# EAGLE design td-1x4 (EAGLE 6.6.0)
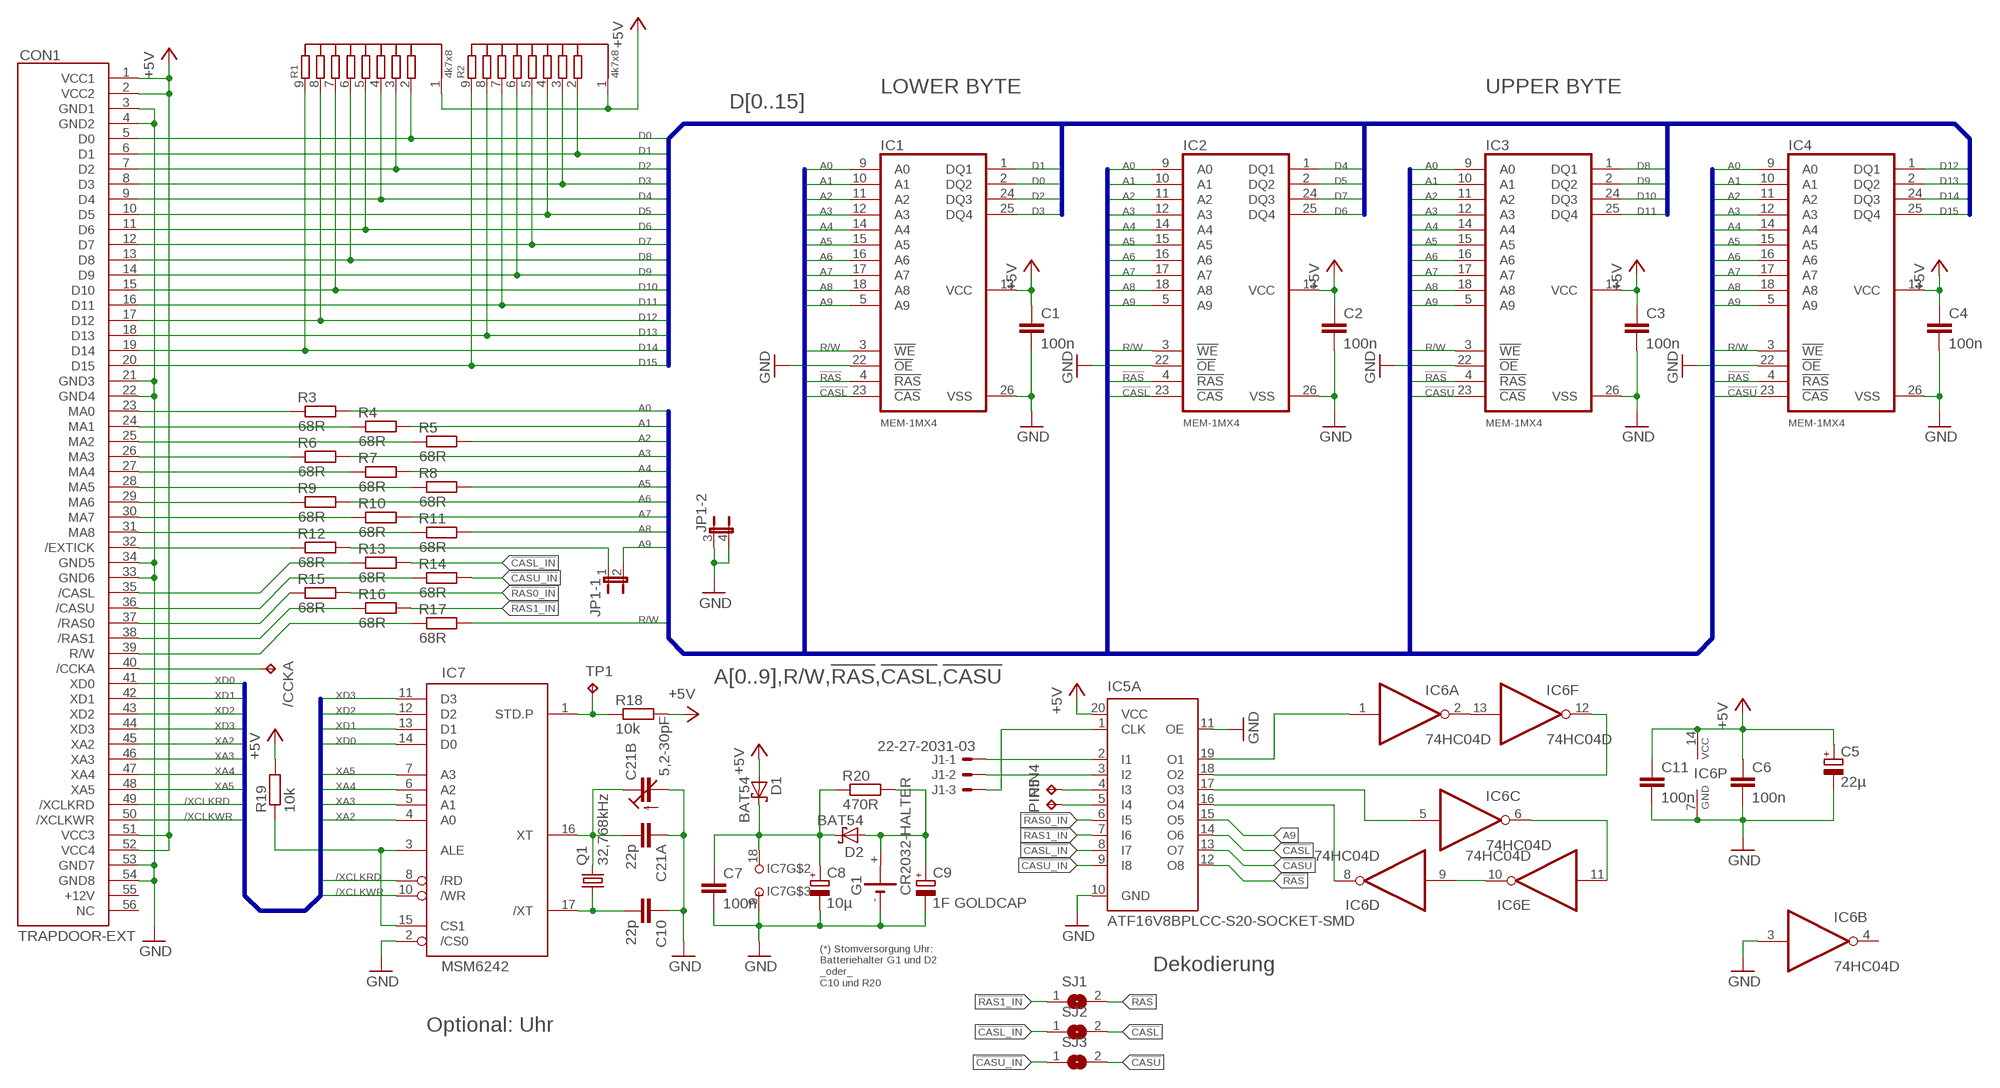
[diagram p0: schematic, sheet 1]

## Parts
/CCKA  PIN2  TPB1,27  [B1,27]
C1  100n  C-EUC0805  [C0805]
C2  100n  C-EUC0805  [C0805]
C3  100n  C-EUC0805  [C0805]
C4  100n  C-EUC0805  [C0805]
C5  22µ  CPOL-EUSMCC  [SMC_C]
C6  100n  C-EUC0805  [C0805]
C7  100n  C-EUC0805  [C0805]
C8  10µ  CPOL-EUSMCA  [SMC_A]
C9  1F GOLDCAP  GOLDCAP5GOLDCAP20-5  [GOLDCAP-5]
C10  22p  C-EUC0805  [C0805]
C11  100n  C-EUC0805  [C0805]
C21A  22p  C-EUC0805  [C0805]
C21B  5,2-30pF  C-TRIMM3050.504  [CTRIM3050.504]
CON1  TRAPDOOR-EXT  [2X28/90]
D1  BAT54  [SOT23]
D2  BAT54  [SOT23]
G1  CR2032-HALTER  CR2032HCR2032-HALTER  [HALTER2032]
IC1  MEM-1MX4  [SOJ26-20]
IC2  MEM-1MX4  [SOJ26-20]
IC3  MEM-1MX4  [SOJ26-20]
IC4  MEM-1MX4  [SOJ26-20]
IC5A  ATF16V8BPLCC-S20-SOCKET-SMD  [PLCC-S20-SOCKET-SMD]
IC6  74HC04D  [SO14]
IC7  MSM6242  [DIL18]
J1  22-27-2031-03  [6410-03]
JP1  JP2QE  [JP2Q]
PIN4  PIN4  TPB1,27  [B1,27]
PIN5  PIN5  TPB1,27  [B1,27]
Q1  32,768kHz  CRYSTALTC26V  [TC26V]
R1  4k7x8  RESNET8  [RN-9]
R2  4k7x8  RESNET8  [RN-9]
R3  68R  R-EU_R0805  [R0805]
R4  68R  R-EU_R0805  [R0805]
R5  68R  R-EU_R0805  [R0805]
R6  68R  R-EU_R0805  [R0805]
R7  68R  R-EU_R0805  [R0805]
R8  68R  R-EU_R0805  [R0805]
R9  68R  R-EU_R0805  [R0805]
R10  68R  R-EU_R0805  [R0805]
R11  68R  R-EU_R0805  [R0805]
R12  68R  R-EU_R0805  [R0805]
R13  68R  R-EU_R0805  [R0805]
R14  68R  R-EU_R0805  [R0805]
R15  68R  R-EU_R0805  [R0805]
R16  68R  R-EU_R0805  [R0805]
R17  68R  R-EU_R0805  [R0805]
R18  10k  R-EU_R0805  [R0805]
R19  10k  R-EU_R0805  [R0805]
R20  470R  R-EU_R0805  [R0805]
SJ1  SJ  [SJ]
SJ2  SJ  [SJ]
SJ3  SJ  [SJ]
TP1  TPB1,27  [B1,27]

## Nets
!CASL: IC1.23(!CAS) IC2.23(!CAS) IC5A.14(O6) SJ2.2
!CASL_IN: IC5A.8(I7) R13.2 SJ2.1
!CASU: IC3.23(!CAS) IC4.23(!CAS) IC5A.13(O7) SJ3.2
!CASU_IN: IC5A.9(I8) R14.2 SJ3.1
!EXRAM: CON1.32(/EXTICK) R12.1
!RAS: IC1.4(!RAS) IC2.4(!RAS) IC3.4(!RAS) IC4.4(!RAS) IC5A.12(O8) SJ1.2
!RAS0_IN: IC5A.6(I5) R15.2
!RAS1_IN: IC5A.7(I6) R16.2 SJ1.1
+5V [power]: C1.1 C2.1 C3.1 C4.1 C5.+ C6.1 C11.1 CON1.1(VCC1) CON1.2(VCC2) CON1.51(VCC3) CON1.52(VCC4) D1.1(A) IC1.13(VCC) IC2.13(VCC) IC3.13(VCC) IC4.13(VCC) IC5A.20(VCC) IC6.14(P:VCC) R1.1 R2.1 R18.2 R19.2
/XCLKRD: CON1.49(/XCLKRD) IC7.8(/RD)
/XCLKWR: CON1.50(/XCLKWR) IC7.10(/WR)
A0: IC1.9(A0) IC2.9(A0) IC3.9(A0) IC4.9(A0) R3.2
A1: IC1.10(A1) IC2.10(A1) IC3.10(A1) IC4.10(A1) R4.2
A2: IC1.11(A2) IC2.11(A2) IC3.11(A2) IC4.11(A2) R5.2
A3: IC1.12(A3) IC2.12(A3) IC3.12(A3) IC4.12(A3) R6.2
A4: IC1.14(A4) IC2.14(A4) IC3.14(A4) IC4.14(A4) R7.2
A5: IC1.15(A5) IC2.15(A5) IC3.15(A5) IC4.15(A5) R8.2
A6: IC1.16(A6) IC2.16(A6) IC3.16(A6) IC4.16(A6) R9.2
A7: IC1.17(A7) IC2.17(A7) IC3.17(A7) IC4.17(A7) R10.2
A8: IC1.18(A8) IC2.18(A8) IC3.18(A8) IC4.18(A8) R11.2
A9: IC1.5(A9) IC2.5(A9) IC3.5(A9) IC4.5(A9) IC5A.15(O5) JP1.2
D0: CON1.5(D0) IC1.2(DQ2) R1.2
D1: CON1.6(D1) IC1.1(DQ1) R2.2
D2: CON1.7(D2) IC1.24(DQ3) R1.3
D3: CON1.8(D3) IC1.25(DQ4) R2.3
D4: CON1.9(D4) IC2.1(DQ1) R1.4
D5: CON1.10(D5) IC2.2(DQ2) R2.4
D6: CON1.11(D6) IC2.25(DQ4) R1.5
D7: CON1.12(D7) IC2.24(DQ3) R2.5
D8: CON1.13(D8) IC3.1(DQ1) R1.6
D9: CON1.14(D9) IC3.2(DQ2) R2.6
D10: CON1.15(D10) IC3.24(DQ3) R1.7
D11: CON1.16(D11) IC3.25(DQ4) R2.7
D12: CON1.17(D12) IC4.1(DQ1) R1.8
D13: CON1.18(D13) IC4.2(DQ2) R2.8
D14: CON1.19(D14) IC4.24(DQ3) R1.9
D15: CON1.20(D15) IC4.25(DQ4) R2.9
GND [power]: C1.2 C2.2 C3.2 C4.2 C5.- C6.2 C7.2 C8.- C9.- C10.1 C11.2 C21A.1 C21B.2(A) CON1.3(GND1) CON1.4(GND2) CON1.21(GND3) CON1.22(GND4) CON1.33(GND6) CON1.34(GND5) CON1.53(GND7) CON1.54(GND8) G1.- IC1.22(!OE) IC1.26(VSS) IC2.22(!OE) IC2.26(VSS) IC3.22(!OE) IC3.26(VSS) IC4.22(!OE) IC4.26(VSS) IC5A.10(GND) IC5A.11(OE) IC6.3(B:I) IC6.7(P:GND) IC7.2(/CS0) IC7.9(-UB) JP1.3 JP1.4
N$1: CON1.23(MA0) R3.1
N$2: CON1.24(MA1) R4.1
N$3: CON1.25(MA2) R5.1
N$4: CON1.26(MA3) R6.1
N$5: CON1.28(MA5) R8.1
N$6: CON1.27(MA4) R7.1
N$7: CON1.38(/RAS1) R16.1
N$8: CON1.29(MA6) R9.1
N$9: CON1.30(MA7) R10.1
N$10: CON1.31(MA8) R11.1
N$11: CON1.35(/CASL) R13.1
N$12: CON1.36(/CASU) R14.1
N$13: IC5A.18(O2) IC6.12(F:O)
N$14: CON1.39(R/W) R17.1
N$15: C21A.2 C21B.1(E) IC7.16(XT) Q1.2
N$16: C10.2 IC7.17(/XT) Q1.1
N$17: IC7.3(ALE) IC7.15(CS1) R19.1
N$18: IC5A.3(I2) J1.2
N$19: IC7.1(STD.P) R18.1 TP1.TP
N$20: C9.+ D2.1(A) G1.+ R20.2
N$21 [power]: C7.1 C8.+ D1.3(C) D2.3(C) IC7.18(+UB) R20.1
N$22: IC5A.4(I3) PIN4.TP
N$23: IC5A.5(I4) PIN5.TP
N$24: IC6.9(D:I) IC6.10(E:O)
N$25: IC5A.16(O4) IC6.8(D:O)
N$26: IC5A.17(O3) IC6.5(C:I)
N$27: CON1.37(/RAS0) R15.1
N$28: IC6.2(A:O) IC6.13(F:I)
N$29: IC5A.19(O1) IC6.1(A:I)
N$30: IC5A.1(CLK) J1.3
N$31: IC6.6(C:O) IC6.11(E:I)
N$32: IC5A.2(I1) J1.1
N$33: /CCKA.TP CON1.40(/CCKA)
N$34: JP1.1 R12.2
R/W: IC1.3(!WE) IC2.3(!WE) IC3.3(!WE) IC4.3(!WE) R17.2
XA2: CON1.45(XA2) IC7.4(A0)
XA3: CON1.46(XA3) IC7.5(A1)
XA4: CON1.47(XA4) IC7.6(A2)
XA5: CON1.48(XA5) IC7.7(A3)
XD0: CON1.41(XD0) IC7.14(D0)
XD1: CON1.42(XD1) IC7.13(D1)
XD2: CON1.43(XD2) IC7.12(D2)
XD3: CON1.44(XD3) IC7.11(D3)
Unconnected: CON1.55(+12V) CON1.56(NC) IC6.4(B:O)

## Buses
D[0..15]
XD[0..3],XA[2..5],/XCLKRD,/XCLKWR
A[0..9],R/W,!RAS,!CASL,!CASU

## Notes on the sheet
- LOWER BYTE | UPPER BYTE
- Dekodierung
- (*) Stomversorgung Uhr:
  Batteriehalter G1 und D2
  _oder_
  C10 und R20
- Optional: Uhr

## Library data of the parts
/CCKA PIN4 PIN5 TP1 = testpad:TP: Test pad
C1-C4 C6 C7 C10 C11 C21A = rcl:C-EU: CAPACITOR, European symbol
C5 C8 = rcl:CPOL-EU: POLARIZED CAPACITOR, European symbol
C9 = 00-own-parts:GOLDCAP5
C21B = rcl:C-TRIMM: Trimm capacitor
CON1 = amiga:TRAPDOOR-EXT
D1 D2 = diode:BAT54: Schottky Diodes Source: Fairchild .. BAT54.pdf
G1 = 00-own-parts:CR2032H: LI BATTERY Varta
IC1-IC4 = amiga:MEM-1MX4
IC5A = amiga:ATF16V8B: High perfomance CMOS (electrically erasable) programmable logic device (PLD) ABLE-Atmel-ABEL - P18V8R, P16V8C, P16V8AS, P17V8 COPL Atmel-WinCUPL - G16V8MS, G16V8MA, G16V8AS, G16V8 LOG/IC - GAL16V8_R, GAL16V8_G7, GAL16V8_C), GAL16V8 Tango-PLD - G16V8R, G16V8C, G16V8AS, G16V8 Source: http://www.atmel.com/dyn/resources/prod_documents/DOC0364.PDF
IC6 = 74xx-eu:74*04: Hex INVERTER
IC7 = 00-own-parts:MSM6242
J1 = con-molex:22-?-03: CONNECTOR wire to board 2.54 mm (.1 inch) pitch header; OC_FARNELL: unknown; OC_NEWARK: unknown
JP1 = jumper:JP2QE: JUMPER
Q1 = crystal:CRYSTAL: CRYSTAL; OC_FARNELL: unknown; OC_NEWARK: unknown
R1 R2 = 00-own-parts:RESNET8
R3-R20 = rcl:R-EU_: RESISTOR, European symbol
SJ1-SJ3 = jumper:SJ: SMD solder JUMPER

## Net classes
0 default: width 0.203 mm, drill 0.3 mm
1 power: width 0.406 mm, drill 0.5 mm

## Board
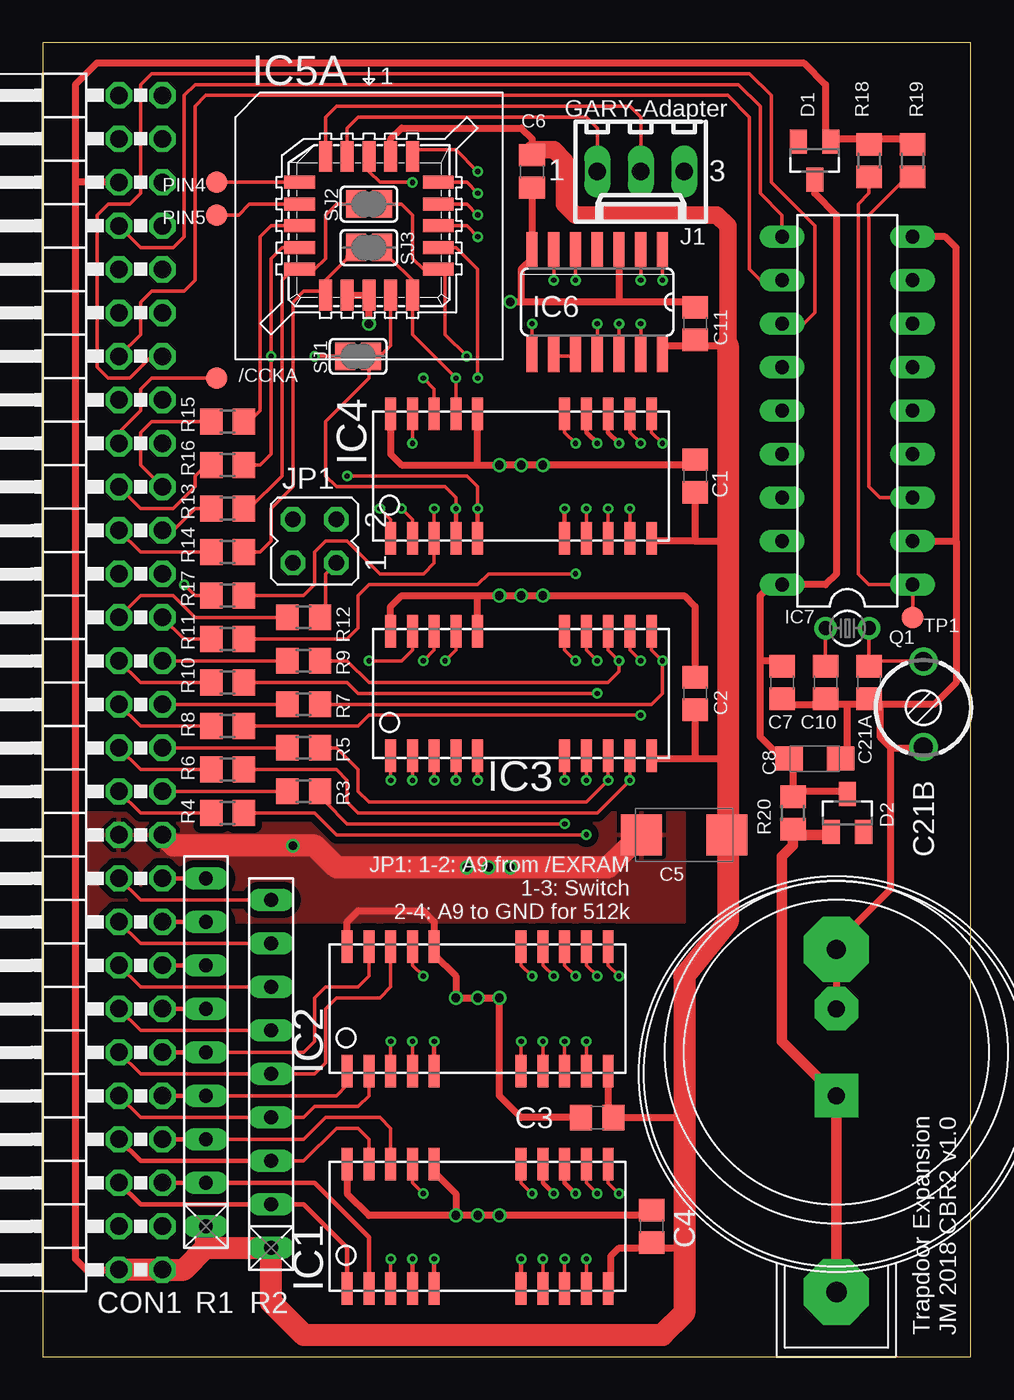
[diagram p1: board, top side]
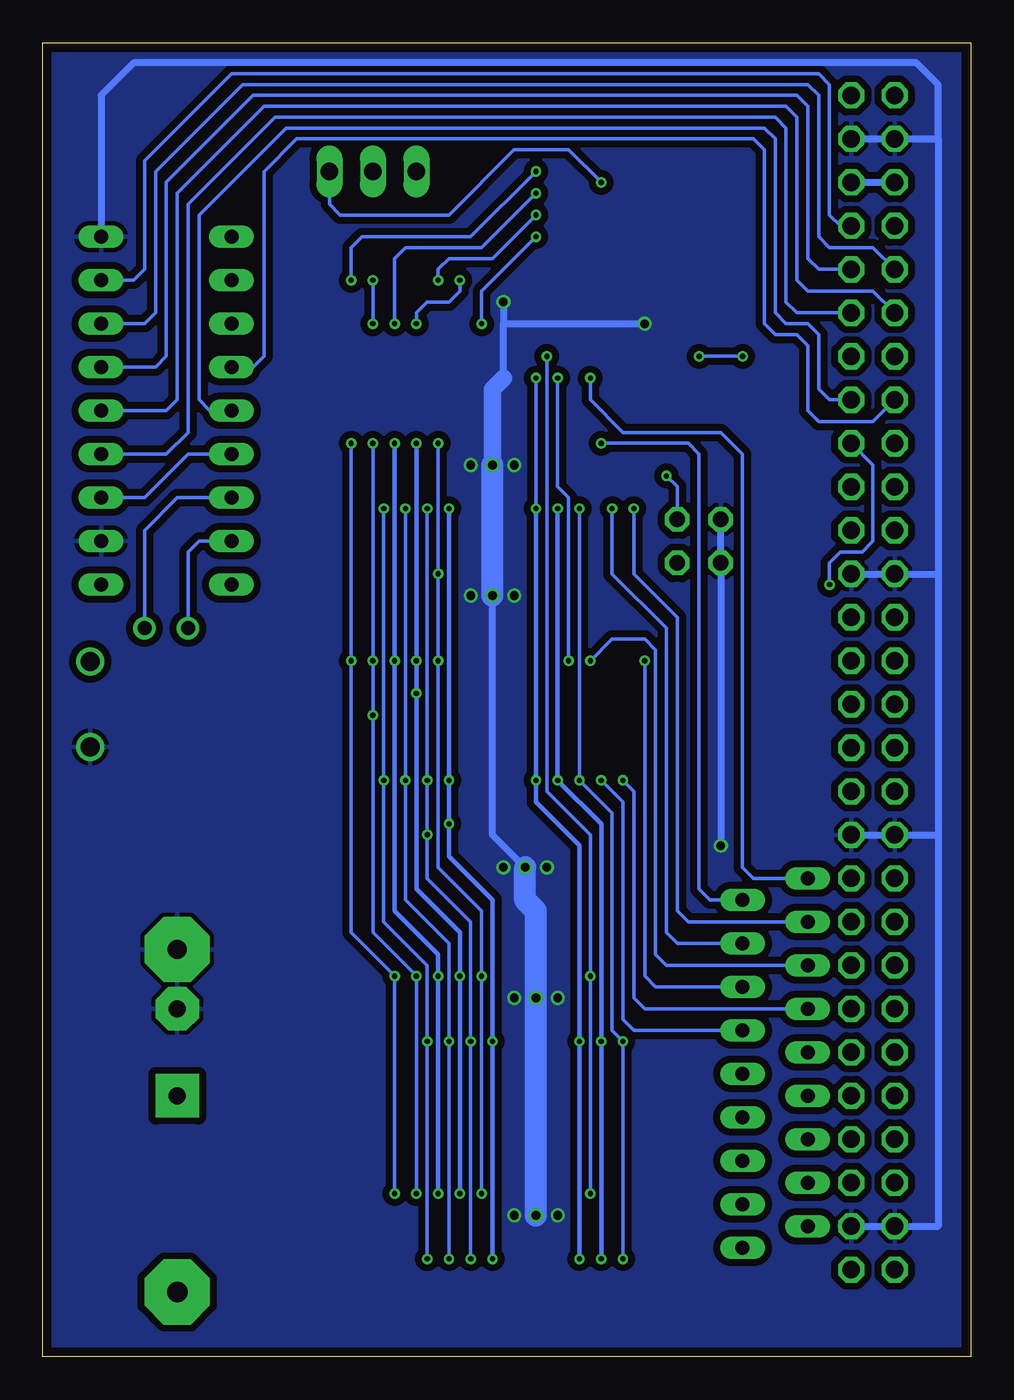
[diagram p2: board, bottom side, seen from below]

Size 54.2 x 76.73 mm. Coordinates in mm from the lower left corner, seen from the top.
Outline: 0,76.73 0,0 54.2,0 54.2,76.73 0,76.73
Copper layers (1*16): Top 0.035mm / dielectric 1.5mm / Bottom 0.035mm
Design rules "EagleRules": minimum track width 7mil, minimum drill 12mil, track to track 7mil, track to pad 7mil, pad to pad 7mil, via to via 7mil, smd to smd 0mil, copper to edge 20mil, drill to drill 10mil, minimum pad ring 10mil, minimum via ring 6mil, stop-mask expansion 2mil, vias tented up to drill 25mil, thermal gap 10mil

### Footprints (pad centres in the part's own frame; a part is rotated, then mirrored left to right if it is on the bottom)
B1,27 = smd 1.27 x 1.27: TP 0,0
C0805 = smd 1.3 x 1.5: 1 -0.95,0; 2 0.95,0
SMC_C = smd 2.4 x 2.4: + -2.5,0; - 2.5,0
SMC_A = smd 1.6 x 1.4: + -1.5,0; - 1.5,0
GOLDCAP-5 = drill 1 pad 2.54 square: + -2.54,0 | drill 1 pad 2.54 octagon: - 2.54,0
CTRIM3050.504 = drill 1.1: 1 -2.5,0; 2 2.5,0
2X28/90 = drill 1.016 octagon: 1 -24.13,-6.35; 2 -24.13,-3.81; 3 -21.59,-6.35; 4 -21.59,-3.81; 5 -19.05,-6.35; 6 -19.05,-3.81; 7 -16.51,-6.35; 8 -16.51,-3.81; 9 -13.97,-6.35; 10 -13.97,-3.81; 11 -11.43,-6.35; 12 -11.43,-3.81; 13 -8.89,-6.35; 14 -8.89,-3.81; 15 -6.35,-6.35; 16 -6.35,-3.81; 17 -3.81,-6.35; 18 -3.81,-3.81; 19 -1.27,-6.35; 20 -1.27,-3.81; 21 1.27,-6.35; 22 1.27,-3.81; 23 3.81,-6.35; 24 3.81,-3.81; 25 6.35,-6.35; 26 6.35,-3.81; 27 8.89,-6.35; 28 8.89,-3.81; 29 11.43,-6.35; 30 11.43,-3.81; 31 13.97,-6.35; 32 13.97,-3.81; 33 16.51,-6.35; 34 16.51,-3.81; 35 19.05,-6.35; 36 19.05,-3.81; 37 21.59,-6.35; 38 21.59,-3.81; 39 24.13,-6.35; 40 24.13,-3.81; 41 26.67,-6.35; 42 26.67,-3.81; 43 29.21,-6.35; 44 29.21,-3.81; 45 31.75,-6.35; 46 31.75,-3.81; 47 34.29,-6.35; 48 34.29,-3.81; 49 36.83,-6.35; 50 36.83,-3.81; 51 39.37,-6.35; 52 39.37,-3.81; 53 41.91,-6.35; 54 41.91,-3.81; 55 44.45,-6.35; 56 44.45,-3.81
SOT23 = smd 1 x 1.4: 1 -0.95,-1.1; 2 0.95,-1.1; 3 0,1.1
HALTER2032 = drill 1.2 pad 3.81 octagon: + 14,0 | drill 1.1 pad 3.81 octagon: - -6,0
SOJ26-20 = smd 0.635 x 1.905: 1 -7.62,-3.632; 2 -6.35,-3.632; 3 -5.08,-3.632; 4 -3.81,-3.632; 5 -2.54,-3.632; 9 2.54,-3.632; 10 3.81,-3.632; 11 5.08,-3.632; 12 6.35,-3.632; 13 7.62,-3.632; 14 7.62,3.632; 15 6.35,3.632; 16 5.08,3.632; 17 3.81,3.632; 18 2.54,3.632; 22 -2.54,3.632; 23 -3.81,3.632; 24 -5.08,3.632; 25 -6.35,3.632; 26 -7.62,3.632
PLCC-S20-SOCKET-SMD = smd 0.76 x 1.8: 1 0,4.05; 2 -1.27,4.05; 3 -2.54,4.05; 9 -2.54,-4.05; 10 -1.27,-4.05; 11 0,-4.05; 12 1.27,-4.05; 13 2.54,-4.05; 19 2.54,4.05; 20 1.27,4.05 | smd 1.8 x 0.76: 4 -4.05,2.54; 5 -4.05,1.27; 6 -4.05,0; 7 -4.05,-1.27; 8 -4.05,-2.54; 14 4.05,-2.54; 15 4.05,-1.27; 16 4.05,0; 17 4.05,1.27; 18 4.05,2.54
SO14 = smd 0.66 x 2.032: 1 -3.81,-3.073; 2 -2.54,-3.073; 3 -1.27,-3.073; 4 0,-3.073; 5 1.27,-3.073; 6 2.54,-3.073; 7 3.81,-3.073; 8 3.81,3.073; 9 2.54,3.073; 10 1.27,3.073; 11 0,3.073; 12 -1.27,3.073; 13 -2.54,3.073; 14 -3.81,3.073
DIL18 = drill 0.813 long: 1 -10.16,-3.81; 2 -7.62,-3.81; 3 -5.08,-3.81; 4 -2.54,-3.81; 5 0,-3.81; 6 2.54,-3.81; 7 5.08,-3.81; 8 7.62,-3.81; 9 10.16,-3.81; 10 10.16,3.81; 11 7.62,3.81; 12 5.08,3.81; 13 2.54,3.81; 14 0,3.81; 15 -2.54,3.81; 16 -5.08,3.81; 17 -7.62,3.81; 18 -10.16,3.81
6410-03 = drill 1.016 long: 1 2.54,0; 2 0,0; 3 -2.54,0
JP2Q = drill 0.914 octagon: 1 -1.27,-1.27; 2 1.27,-1.27; 3 -1.27,1.27; 4 1.27,1.27
TC26V = drill 0.813: 1 -1.27,0; 2 1.27,0
RN-9 = drill 0.813 long: 1 -10.16,0; 2 -7.62,0; 3 -5.08,0; 4 -2.54,0; 5 0,0; 6 2.54,0; 7 5.08,0; 8 7.62,0; 9 10.16,0
R0805 = smd 1.3 x 1.5: 1 -0.95,0; 2 0.95,0
SJ = smd 1.168 x 1.6: 1 -0.762,0; 2 0.762,0

### Placement (x,y rotation side)
/CCKA  10.16,57.15 0 top
C1  38.1,51.44 90 top
C2  38.1,38.73 90 top
C3  32.38,13.97 180 top
C4  35.56,7.62 90 top
C5  37.47,30.48 180 top
C6  28.57,69.22 270 top
C7  43.18,39.37 270 top
C8  45.09,34.92 0 top
C9  46.35,17.78 90 top
C10  45.72,39.37 90 top
C11  38.1,60.33 90 top
C21A  48.26,39.37 90 top
C21B  51.44,38.1 270 top
CON1  0.64,29.21 90 top
D1  45.09,69.85 180 top
D2  46.99,31.75 0 top
G1  46.35,17.78 270 top
IC1  25.4,7.62 0 top
IC2  25.4,20.32 0 top
IC3  27.94,38.73 0 top
IC4  27.94,51.44 0 top
IC5A  19.05,66.04 0 top
IC6  32.38,61.59 180 top
IC7  46.99,55.24 90 top
J1  34.92,69.22 180 top
JP1  15.88,47.62 90 top
PIN4  10.16,68.58 0 top
PIN5  10.16,66.67 0 top
Q1  46.99,42.55 0 top
R1  9.53,17.78 90 top
R2  13.34,16.51 90 top
R3  15.24,33.02 0 top
R4  10.79,31.75 0 top
R5  15.24,35.56 0 top
R6  10.79,34.29 0 top
R7  15.24,38.1 0 top
R8  10.79,36.83 0 top
R9  15.24,40.64 0 top
R10  10.79,39.37 0 top
R11  10.79,41.91 0 top
R12  15.24,43.18 0 top
R13  10.79,49.53 0 top
R14  10.79,46.99 0 top
R15  10.79,54.61 0 top
R16  10.79,52.07 0 top
R17  10.79,44.45 0 top
R18  48.26,69.85 90 top
R19  50.8,69.85 90 top
R20  43.81,31.75 270 top
SJ1  18.41,58.42 0 top
SJ2  19.05,67.31 0 top
SJ3  19.05,64.77 0 top
TP1  50.8,43.18 270 top

### Tracks (layer width: path | path; a pad name or v marks a point on that pad's centre or on a via)
!CASL  (via drill 0.3)
  Top 0.203: v22.23,9.53 21.59,10.16 IC1.23 | IC2.23 21.59,22.86 v22.23,22.23 | v24.77,58.42 23.5,59.69 23.5,63.5 IC5A.14 22.23,63.5 21.59,64.14 21.59,66.67 20.95,67.31 SJ2.2
  Bottom 0.203: v22.23,9.53 v22.23,22.23 22.23,30.48 24.77,33.02 v24.77,58.42
!CASL_IN
  Top 0.203: R13.2 12.06,49.53 13.97,51.44 13.97,62.87 14.61,63.5 IC5A.8 15.88,63.5 16.51,64.14 16.51,66.67 17.14,67.31 SJ2.1
!CASU  (via drill 0.3)
  Top 0.203: IC4.23 v24.13,57.15 21.59,59.69 IC5A.13 21.59,62.87 20.32,64.14 20.32,64.26 SJ3.2 | v23.5,40.64 24.13,41.27 IC3.23
  Bottom 0.203: v24.13,57.15 24.13,50.8 23.5,50.16 v23.5,40.64
!CASU_IN
  Top 0.203: R14.2 12.7,46.99 13.34,47.62 13.34,49.53 14.61,50.8 14.61,61.59 15.24,62.23 16.27,62.23 | 16.27,62.23 IC5A.9 | 16.27,62.23 16.27,62.62 17.78,64.14 17.78,64.26 SJ3.1
!EXRAM
  Top 0.203: CON1.32 5.71,44.45 7.62,44.45 8.89,43.18 R12.1
!RAS  (via drill 0.3)
  Top 0.203: IC2.4 v21.59,18.41 | IC3.4 v24.13,33.66 | v24.13,49.53 24.13,50.16 23.5,50.8 17.14,50.8 16.51,51.44 16.51,54.61 19.05,57.15 19.05,58.29 SJ1.2 19.68,58.42 20.32,59.05 IC5A.12
  Top 0.254: IC1.4 v21.59,5.71 | v24.13,49.53 IC4.4
  Bottom 0.254: v21.59,5.71 v21.59,18.41 21.59,31.11 v24.13,33.66 v24.13,49.53
!RAS0_IN
  Top 0.203: 11.74,54.92 R15.2 12.06,54.61 12.7,55.24 12.7,65.41 13.34,66.04 IC5A.6
!RAS1_IN  (via drill 0.3)
  Top 0.203: R16.2 12.7,52.07 13.34,52.7 v13.34,58.42 13.34,64.14 13.97,64.77 IC5A.7 | SJ1.1 v15.88,58.42
  Bottom 0.203: v15.88,58.42 v13.34,58.42
+5V
  Top 0.406: 38.1,47.62 35.74,47.62 IC4.13 | IC1.13 33.2,3.81 33.2,5.89 33.66,6.35 35.24,6.35 C4.1 35.56,6.35 37.47,6.35 | 45.72,71.27 45.72,74.3 44.45,75.56 3.17,75.56 1.91,74.3 1.91,68.58 | 45.72,71.27 D1.1 | 45.72,71.27 46.2,71.27 46.35,71.12 47.94,71.12 R18.2 48.26,71.12 50.48,71.12 R19.2 | 1.91,68.58 1.91,5.71 2.54,5.08 CON1.2 | 38.1,34.92 35.74,34.92 IC3.13 | 38.1,34.92 40.01,34.92 | C1.1 38.1,47.62 | 38.1,47.62 40.01,47.62 | C5.+ 40.01,29.84 | C2.1 38.1,34.92 | 37.47,13.97 C3.1 33.02,14.29 IC2.13 | IC5A.20 20.32,71.12 20.95,71.75 27.94,71.75 28.57,71.12 28.57,70.48 C6.1 | IC6.14 36.2,59.05 38.1,59.05 | 38.1,59.05 40.01,59.05 | C11.1 38.1,59.05 | CON1.52 1.91,68.58
  Top 1.016: 40.01,59.05 40.01,66.04 39.37,66.67 31.11,66.67 30.48,67.31 30.48,69.85 29.84,70.48 28.57,70.48
  Top 1.27: R1.1 9.53,6.35 | 9.53,6.35 R2.1 13.34,3.17 15.24,1.27 36.2,1.27 37.47,2.54 37.47,6.35 37.47,13.97 37.47,22.23 40.01,25.4 40.01,29.84 40.01,34.92 40.01,47.62 40.01,59.05 | 9.53,6.35 8.26,5.08 CON1.1 CON1.2
  Bottom 0.406: CON1.51 CON1.52
/XCLKRD
  Bottom 0.203: CON1.49 7.62,66.04 8.26,66.67 8.26,74.3 8.89,74.93 43.18,74.93 48.26,69.85 48.26,63.5 48.9,62.87 IC7.8
/XCLKWR
  Top 0.203: CON1.50 5.71,64.77 7.62,64.77 8.26,65.41 8.26,73.66 8.89,74.3 40.64,74.3 41.91,73.03 41.91,67.94 43.18,66.67 IC7.10
A0  (via drill 0.3)
  Top 0.203: IC3.9 v30.48,33.66 | IC2.9 v27.94,18.41 | R3.2 16.51,33.02 16.51,32.38 17.78,31.11 v30.48,31.11
  Top 0.254: IC1.9 v27.94,5.71 | v30.48,49.53 IC4.9
  Bottom 0.254: v27.94,5.71 v27.94,18.41 27.94,26.67 30.48,29.21 v30.48,31.11 v30.48,33.66 v30.48,49.53
A1  (via drill 0.3)
  Top 0.203: IC4.10 v31.75,49.53 | v29.21,5.71 IC1.10 | IC3.10 v31.75,33.66 | IC2.10 v29.21,18.41 | R4.2 15.88,31.75 17.14,30.48 v31.75,30.48
  Bottom 0.203: v31.75,49.53 v31.75,33.66 v31.75,30.48 31.75,27.94 29.21,25.4 v29.21,18.41 v29.21,5.71
A2  (via drill 0.3)
  Top 0.203: IC4.11 v33.02,49.53 | v30.48,5.71 IC1.11 | IC3.11 v33.02,33.66 31.75,32.38 19.05,32.38 18.41,33.02 18.41,34.29 17.14,35.56 R5.2 | IC2.11 v30.48,18.41
  Bottom 0.203: v33.02,49.53 v33.02,33.66 33.02,26.67 30.48,24.13 v30.48,18.41 v30.48,5.71
A3  (via drill 0.3)
  Top 0.203: IC4.12 v34.29,49.53 | v31.75,5.71 IC1.12 | IC3.12 v34.29,33.66 32.38,31.75 18.41,31.75 17.78,32.38 17.78,33.66 17.14,34.29 R6.2 | IC2.12 v31.75,18.41
  Bottom 0.203: v34.29,49.53 v34.29,33.66 34.29,25.4 31.75,22.86 v31.75,18.41 v31.75,5.71
A4  (via drill 0.3)
  Top 0.203: IC1.14 33.02,10.16 v33.66,9.53 | v36.2,53.34 35.56,53.98 IC4.14 | IC3.14 35.56,41.27 v36.2,40.64 36.2,38.73 35.56,38.1 R7.2 | IC2.14 33.02,22.86 v33.66,22.23
  Bottom 0.203: v33.66,9.53 v33.66,22.23 36.2,24.77 v36.2,40.64 v36.2,53.34
A5  (via drill 0.3)
  Top 0.203: IC4.15 34.29,53.98 v34.92,53.34 | v32.38,9.53 31.75,10.16 IC1.15 | IC3.15 34.29,41.27 v34.92,40.64 | IC2.15 31.75,22.86 v32.38,22.23 | R8.2 18.41,36.83 19.05,37.47 v34.92,37.47
  Bottom 0.203: v34.92,53.34 v34.92,40.64 v34.92,37.47 34.92,24.77 v32.38,22.23 v32.38,9.53
A6  (via drill 0.3)
  Top 0.203: IC3.16 33.02,41.27 v33.66,40.64 33.66,40.01 33.02,39.37 19.05,39.37 17.78,40.64 R9.2 | IC2.16 30.48,22.86 v31.11,22.23
  Top 0.254: IC4.16 33.02,53.98 v33.66,53.34 | v31.11,9.53 30.48,10.16 IC1.16
  Bottom 0.254: v33.66,53.34 v33.66,40.64 33.66,26.04 31.11,23.5 v31.11,22.23 v31.11,9.53
A7  (via drill 0.3)
  Top 0.203: IC3.17 31.75,41.27 v32.38,40.64 | IC2.17 29.21,22.86 v29.84,22.23 | R10.2 17.78,39.37 18.41,38.73 v32.38,38.73
  Top 0.254: IC4.17 31.75,53.98 v32.38,53.34 | v29.84,9.53 29.21,10.16 IC1.17
  Bottom 0.254: v32.38,53.34 v32.38,40.64 v32.38,38.73 32.38,27.3 29.84,24.77 v29.84,22.23 v29.84,9.53
A8  (via drill 0.3)
  Top 0.203: IC4.18 30.48,53.98 v31.11,53.34 | v28.57,9.53 27.94,10.16 IC1.18 | IC3.18 30.48,41.27 v31.11,40.64 | IC2.18 27.94,22.86 v28.57,22.23 | v31.11,45.72 26.04,45.72 25.4,45.09 19.05,45.09 18.41,44.45 18.41,42.55 17.78,41.91 R11.2
  Bottom 0.203: v31.11,53.34 v31.11,45.72 v31.11,40.64 31.11,28.57 28.57,26.04 v28.57,22.23 v28.57,9.53
A9  (via drill 0.3)
  Top 0.203: v17.78,51.44 24.77,51.44 25.4,50.8 v25.4,49.53 | IC5A.15 24.13,64.77 25.4,63.5 v25.4,57.15
  Top 0.254: IC1.5 v22.86,5.71 | v25.4,49.53 IC4.5 | IC3.5 v25.4,33.66 | IC2.5 v22.86,18.41
  Bottom 0.203: JP1.2 17.14,50.8 v17.78,51.44 | v25.4,57.15 v25.4,49.53
  Bottom 0.254: v22.86,5.71 v22.86,18.41 22.86,29.84 25.4,32.38 v25.4,33.66 v25.4,49.53
D0
  Top 0.254: CON1.5 R1.2 15.88,10.16 19.05,6.99 IC1.2
D1
  Top 0.254: CON1.6 5.71,8.89 R2.2 15.24,8.89 17.78,6.35 IC1.1
D2
  Top 0.203: IC1.24 20.32,13.34 19.68,13.97 16.51,13.97 15.24,12.7 R1.3
  Top 0.254: CON1.7 R1.3
D3
  Top 0.203: R2.3 15.24,11.43 17.14,13.34 18.41,13.34 19.05,12.7 IC1.25
  Top 0.254: CON1.8 5.71,11.43 R2.3
D4
  Top 0.203: R1.4 17.14,15.24 17.78,15.88 IC2.1
  Top 0.254: CON1.9 R1.4
D5
  Top 0.203: IC2.2 19.05,15.24 18.41,14.61 15.88,14.61 15.24,13.97 R2.4 5.71,13.97 CON1.10
D6
  Top 0.203: R1.5 15.24,17.78 15.88,18.41 15.88,20.95 16.51,21.59 18.41,21.59 19.05,22.23 IC2.25
  Top 0.254: CON1.11 R1.5
D7
  Top 0.203: CON1.12 5.71,16.51 R2.5 15.88,16.51 16.51,17.14 16.51,20.32 17.14,20.95 19.68,20.95 20.32,21.59 IC2.24
D8  (via drill 0.3)
  Top 0.203: v20.32,33.66 IC3.1 20.32,35.56
  Top 0.254: CON1.13 R1.6
  Bottom 0.203: R1.6 19.05,20.32 19.68,20.95 19.68,33.02 v20.32,33.66
D9  (via drill 0.3)
  Top 0.203: CON1.14 5.71,19.05 R2.6 | v21.59,33.66 IC3.2
  Bottom 0.203: v21.59,33.66 20.32,32.38 20.32,19.68 19.68,19.05 R2.6
D10  (via drill 0.3)
  Top 0.203: v22.23,40.64 22.86,41.27 IC3.24
  Top 0.254: CON1.15 R1.7
  Bottom 0.203: R1.7 17.78,22.86 18.41,23.5 18.41,41.27 19.05,41.91 20.95,41.91 v22.23,40.64
D11  (via drill 0.3)
  Top 0.203: CON1.16 5.71,21.59 R2.7 | v19.05,40.64 20.95,40.64 21.59,41.27 IC3.25
  Bottom 0.203: R2.7 18.41,21.59 19.05,22.23 v19.05,40.64
D12  (via drill 0.3)
  Top 0.203: v19.68,49.53 20.32,48.9 IC4.1 20.32,47.62
  Top 0.254: CON1.17 R1.8
  Bottom 0.203: R1.8 16.51,25.4 17.14,26.04 17.14,43.18 19.68,45.72 v19.68,49.53
D13  (via drill 0.3)
  Top 0.203: CON1.18 5.71,24.13 R2.8 | v20.95,49.53 21.59,48.9 IC4.2
  Bottom 0.203: R2.8 17.14,24.13 17.78,24.77 17.78,42.55 20.95,45.72 v20.95,49.53
D14  (via drill 0.3)
  Top 0.203: IC4.24 22.86,56.52 v22.23,57.15
  Top 0.254: CON1.19 R1.9
  Bottom 0.203: R1.9 12.7,27.94 13.34,28.57 13.34,52.7 14.61,53.98 20.32,53.98 22.23,55.88 v22.23,57.15
D15  (via drill 0.3)
  Top 0.203: CON1.20 5.71,26.67 R2.9 | v21.59,53.34 IC4.25 21.59,55.88
  Bottom 0.203: R2.9 15.24,26.67 15.88,27.3 15.88,52.7 16.51,53.34 v21.59,53.34
GND  (via drill 0.5)
  Top 0.406: IC3.22 25.4,44.45 | 25.4,44.45 v26.67,44.45 v27.94,44.45 v29.21,44.45 37.47,44.45 38.1,43.81 C2.2 | IC1.26 17.78,9.53 19.05,8.26 v24.13,8.26 | IC1.22 22.86,10.79 24.13,9.53 v24.13,8.26 | 35.56,8.89 C4.2 35.56,8.26 v26.67,8.26 v25.4,8.26 v24.13,8.26 | IC4.26 20.32,52.7 20.95,52.07 25.4,52.07 | 25.4,52.07 IC4.22 | 48.9,38.1 48.9,36.2 49.53,35.56 | 49.53,35.56 51.4,35.56 C21B.2 | IC7.2 53.34,47.62 | 53.34,47.62 53.34,64.77 52.7,65.41 IC7.9 | C21A.1 48.9,38.1 | 48.9,38.1 46.04,38.1 C10.1 | C10.1 46.03,38.1 43.81,38.1 C7.2 | 49.53,35.56 49.53,27.3 46.99,24.77 G1.- C9.- | 53.34,47.62 53.34,39.37 52.07,38.1 48.9,38.1 | C1.2 38.1,52.07 v29.21,52.07 v27.94,52.07 v26.67,52.07 25.4,52.07 | IC3.26 20.32,43.81 20.95,44.45 25.4,44.45 | C3.2 27.94,13.97 26.67,15.24 v26.67,20.95 v25.4,20.95 v24.13,20.95 24.13,22.23 22.86,23.5 IC2.22 22.86,25.4 22.23,26.04 18.41,26.04 17.78,25.4 IC2.26 | IC5A.10 IC5A.11 v19.05,60.33 | 46.35,34.92 C8.- 46.99,34.92 46.99,38.1 45.72,38.1 C10.1 | C11.2 38.1,60.96 37.47,61.59 33.66,61.59 | 33.66,61.59 27.94,61.59 | 27.94,61.59 v27.3,61.59 | 27.94,61.59 27.94,63.5 28.57,64.14 IC6.7 C6.2 28.57,68.58 | IC6.3 33.66,61.59
  Top 1.27: C5.- 33.02,28.57 v27.3,28.57 v26.04,28.57 v24.77,28.57 17.14,28.57 15.88,29.84 v14.61,29.84 7.62,29.84 CON1.21
  Bottom 0.406: CON1.3 CON1.4 1.91,7.62 1.91,30.48 | CON1.34 CON1.33 1.91,45.72 | 1.91,45.72 1.91,30.48 | CON1.22 CON1.21 1.91,30.48 | 1.91,71.12 CON1.54 CON1.53 | 1.91,71.12 1.91,45.72 | 1.91,71.12 1.91,74.3 3.17,75.56 48.9,75.56 50.8,73.66 IC7.9 | v26.04,28.57 27.94,30.48 v27.94,44.45 | 27.3,57.15 27.3,60.33 | 27.3,60.33 v19.05,60.33 | v14.61,29.84 JP1.3 JP1.4 | v27.3,61.59 27.3,60.33
  Bottom 1.016: v27.94,52.07 27.94,56.52 27.3,57.15
  Bottom 1.27: v25.4,8.26 v25.4,20.95 25.4,26.04 26.04,26.67 v26.04,28.57 | v27.94,44.45 v27.94,52.07
  pour Bottom (isolate 0.406): 0.64,0.64 0.64,76.2 53.98,76.2 53.98,0.64
  pour Top (isolate 0.406): 2.54,31.75 37.47,31.75 37.47,25.4 2.54,25.4
N$1
  Top 0.203: CON1.23 R3.1
N$2
  Top 0.203: CON1.24 5.71,31.75 R4.1
N$3
  Top 0.203: CON1.25 R5.1
N$4
  Top 0.203: CON1.26 5.71,34.29 R6.1
N$5
  Top 0.203: CON1.28 5.71,36.83 R8.1
N$6
  Top 0.203: CON1.27 R7.1
N$7
  Top 0.203: CON1.38 5.71,49.53 7.62,49.53 8.89,50.8 8.89,51.44 9.53,52.07 R16.1
N$8
  Top 0.203: CON1.29 R9.1
N$9
  Top 0.203: CON1.30 5.71,39.37 R10.1
N$10
  Top 0.203: CON1.31 8.26,41.91 R11.1
N$11
  Top 0.203: CON1.35 7.62,48.26 8.89,49.53 R13.1
N$12
  Top 0.203: CON1.36 5.71,46.99 R14.1
N$13  (via drill 0.3)
  Top 0.203: v25.4,67.94 24.77,68.58 IC5A.18 | IC6.12 v33.66,60.33
  Bottom 0.203: v33.66,60.33 33.66,64.14 33.02,64.77 28.57,64.77 v25.4,67.94
N$14  (via drill 0.3)
  Top 0.203: v8.26,45.09 8.89,44.45 R17.1
  Bottom 0.203: CON1.39 5.71,52.07 5.71,47.62 6.35,46.99 7.62,46.99 8.26,46.35 v8.26,45.09
N$15
  Top 0.203: Q1.2 48.26,40.64 | C21A.2 48.26,40.64 | 48.26,40.64 51.4,40.64 C21B.1
  Bottom 0.203: IC7.16 46.35,50.16 48.26,48.26 Q1.2
N$16
  Top 0.203: Q1.1 C10.2
  Bottom 0.203: Q1.1 45.72,46.99 45.09,47.62 IC7.17
N$17
  Top 0.203: R19.1 50.16,68.58 48.26,66.67 48.26,50.8 48.9,50.16 IC7.3
  Bottom 0.203: IC7.3 48.26,50.16 45.72,52.7 IC7.15
N$18
  Top 0.203: IC5A.3 16.51,72.39 17.14,73.03 34.29,73.03 34.92,72.39 J1.2
N$19
  Top 0.203: R18.1 48.26,67.94 47.62,67.31 47.62,45.72 48.26,45.09 IC7.1 TP1.TP
N$20
  Top 0.203: 43.49,30.48 R20.2 43.81,30.48 | 45.87,30.48 D2.1
  Top 0.61: G1.+ C9.+ 43.18,18.41 43.18,29.21 43.81,29.84 43.81,30.48 45.87,30.48
N$21
  Top 0.406: D1.3 45.09,67.94 46.35,66.67 46.35,45.72 45.72,45.09 IC7.18 42.55,45.09 41.91,44.45 41.91,40.64 | D2.3 46.99,33.02 44.13,33.02 R20.1 43.81,34.92 C8.+ 43.18,34.92 41.91,36.2 41.91,40.64 | C7.1 43.18,40.64 41.91,40.64
N$22
  Top 0.203: IC5A.4 PIN4.TP
N$23
  Top 0.203: IC5A.5 12.06,67.31 11.43,66.67 PIN5.TP
N$24
  Top 0.203: IC6.10 31.11,58.42 29.95,58.42 IC6.9
N$25  (via drill 0.3)
  Top 0.203: IC6.8 v28.57,60.33 | v25.4,65.41 24.77,66.04 IC5A.16
  Bottom 0.203: v28.57,60.33 28.57,62.23 v25.4,65.41
N$26  (via drill 0.3)
  Top 0.203: IC5A.17 24.77,67.31 v25.4,66.67 | v31.11,62.87 IC6.5
  Bottom 0.203: v25.4,66.67 27.94,64.14 30.48,64.14 31.11,63.5 v31.11,62.87
N$27
  Top 0.203: CON1.37 5.71,52.07 5.71,53.98 6.35,54.61 R15.1
N$28  (via drill 0.3)
  Top 0.203: IC6.2 v34.92,62.87 | v34.92,60.33 IC6.13
  Bottom 0.203: v34.92,62.87 v34.92,60.33
N$29  (via drill 0.3)
  Top 0.203: IC5A.19 21.59,70.48 24.13,70.48 v25.4,69.22 | v36.2,62.87 IC6.1
  Bottom 0.203: v25.4,69.22 29.21,65.41 35.56,65.41 36.2,64.77 v36.2,62.87
N$30  (via drill 0.3)
  Top 0.203: IC5A.1 19.05,69.22 19.68,68.58 v21.59,68.58
  Bottom 0.203: v21.59,68.58 23.5,70.48 26.67,70.48 30.48,66.67 36.83,66.67 37.47,67.31 J1.3
N$31  (via drill 0.3)
  Top 0.203: IC6.6 v29.84,62.87 | v32.38,60.33 IC6.11
  Bottom 0.203: v29.84,62.87 29.84,62.23 30.48,61.59 31.75,61.59 32.38,60.96 v32.38,60.33
N$32
  Top 0.203: IC5A.2 17.78,71.75 18.41,72.39 31.75,72.39 32.38,71.75 J1.1
N$33
  Top 0.203: CON1.40 4.45,53.98 5.71,55.24 5.71,56.52 6.35,57.15 /CCKA.TP
N$34
  Top 0.203: R12.2 16.51,43.18 16.51,45.72 JP1.1
R/W  (via drill 0.3)
  Top 0.203: IC1.3 v20.32,5.71 | v22.86,49.53 IC4.3 22.86,46.35 22.23,45.72 19.68,45.72 17.78,47.62 16.51,47.62 15.88,46.99 15.88,45.09 15.24,44.45 R17.2 | IC3.3 v22.86,33.66 | IC2.3 v20.32,18.41
  Bottom 0.203: v20.32,5.71 v20.32,18.41 20.95,19.05 20.95,31.75 v22.86,33.66 v22.86,49.53
XA2
  Bottom 0.203: IC7.4 46.99,52.7 45.72,53.98 45.72,67.31 40.64,72.39 11.43,72.39 10.79,71.75 10.79,61.59 10.16,60.96 CON1.45
XA3
  Bottom 0.203: IC7.5 46.99,55.24 46.35,55.88 46.35,67.94 41.27,73.03 10.79,73.03 10.16,72.39 10.16,62.87 9.53,62.23 5.71,62.23 CON1.46
XA4
  Bottom 0.203: IC7.6 47.62,57.78 46.99,58.42 46.99,68.58 41.91,73.66 10.16,73.66 9.53,73.03 9.53,64.14 8.89,63.5 CON1.47
XA5
  Bottom 0.203: IC7.7 48.26,60.33 47.62,60.96 47.62,69.22 42.55,74.3 9.53,74.3 8.89,73.66 8.89,65.41 8.26,64.77 5.71,64.77 CON1.48
XD0
  Bottom 0.203: IC7.14 44.45,55.24 45.09,55.88 45.09,66.67 40.01,71.75 12.06,71.75 11.43,71.12 11.43,60.96 10.79,60.33 9.53,60.33 8.89,59.69 8.89,56.52 8.26,55.88 CON1.41
XD1
  Bottom 0.203: IC7.13 41.91,57.78 41.27,58.42 41.27,69.22 39.37,71.12 12.7,71.12 12.06,70.48 12.06,60.33 11.43,59.69 10.16,59.69 9.53,59.05 9.53,55.24 8.89,54.61 5.71,54.61 CON1.42
XD2
  Top 0.203: CON1.43 6.35,58.42 5.08,57.15 3.81,57.15 3.17,57.78 3.17,66.67 3.81,67.31 5.08,67.31 5.71,67.94 5.71,74.3 6.35,74.93 41.27,74.93 42.55,73.66 42.55,68.58 45.09,66.04 45.09,60.96 44.45,60.33 IC7.12
XD3
  Top 0.203: CON1.44 5.71,59.69 5.71,61.59 6.35,62.23 8.26,62.23 8.89,62.87 8.89,73.03 9.53,73.66 40.01,73.66 41.27,72.39 41.27,63.5 41.91,62.87 IC7.11

### Text on the board
tPlace: GARY-Adapter | JP1: 1-2: A9 from /EXRAM / 1-3: Switch / 2-4: A9 to GND for 512k | Trapdoor Expansion / JM 2018 CBR2 v1.0